# Altium schematic sheet СФ МЭИ ЛБ ПЭ2-18 11.03.04 03 Э3.SchDoc
size 594 x 420 mm; Scale: 1:1; Разраб.: Гончаренко В.Ю.; Пров.: Смолин В.А.; Номер листа: 1; Общее количество листов: 1; Наименование изделия 1: последовательности импульсов; Наименование изделия 2: последовательности импульсов; Наименование изделия 3: последовательности импульсов; Нач. отд.: Нач. отд.; Децимальный номер: СФ МЭИ ЛБ ПЭ2-18 11.03.04 03 Э3; Наименование. Строка 2: последовательности импульсов; Наименование. Строка 3: Схема электирическая принципиальная; Наименование. Строка 1: Генератор однополярной; Разработал: Гончаренк В.Ю.; Проверил: Амелин С.А.; Утвердил: Амелина М.А.; Литера: У; Масштаб: 1:1; Лист. Номер: 1; Лист. Всего: 1; Тип документа: Схема электрическая принципиальная
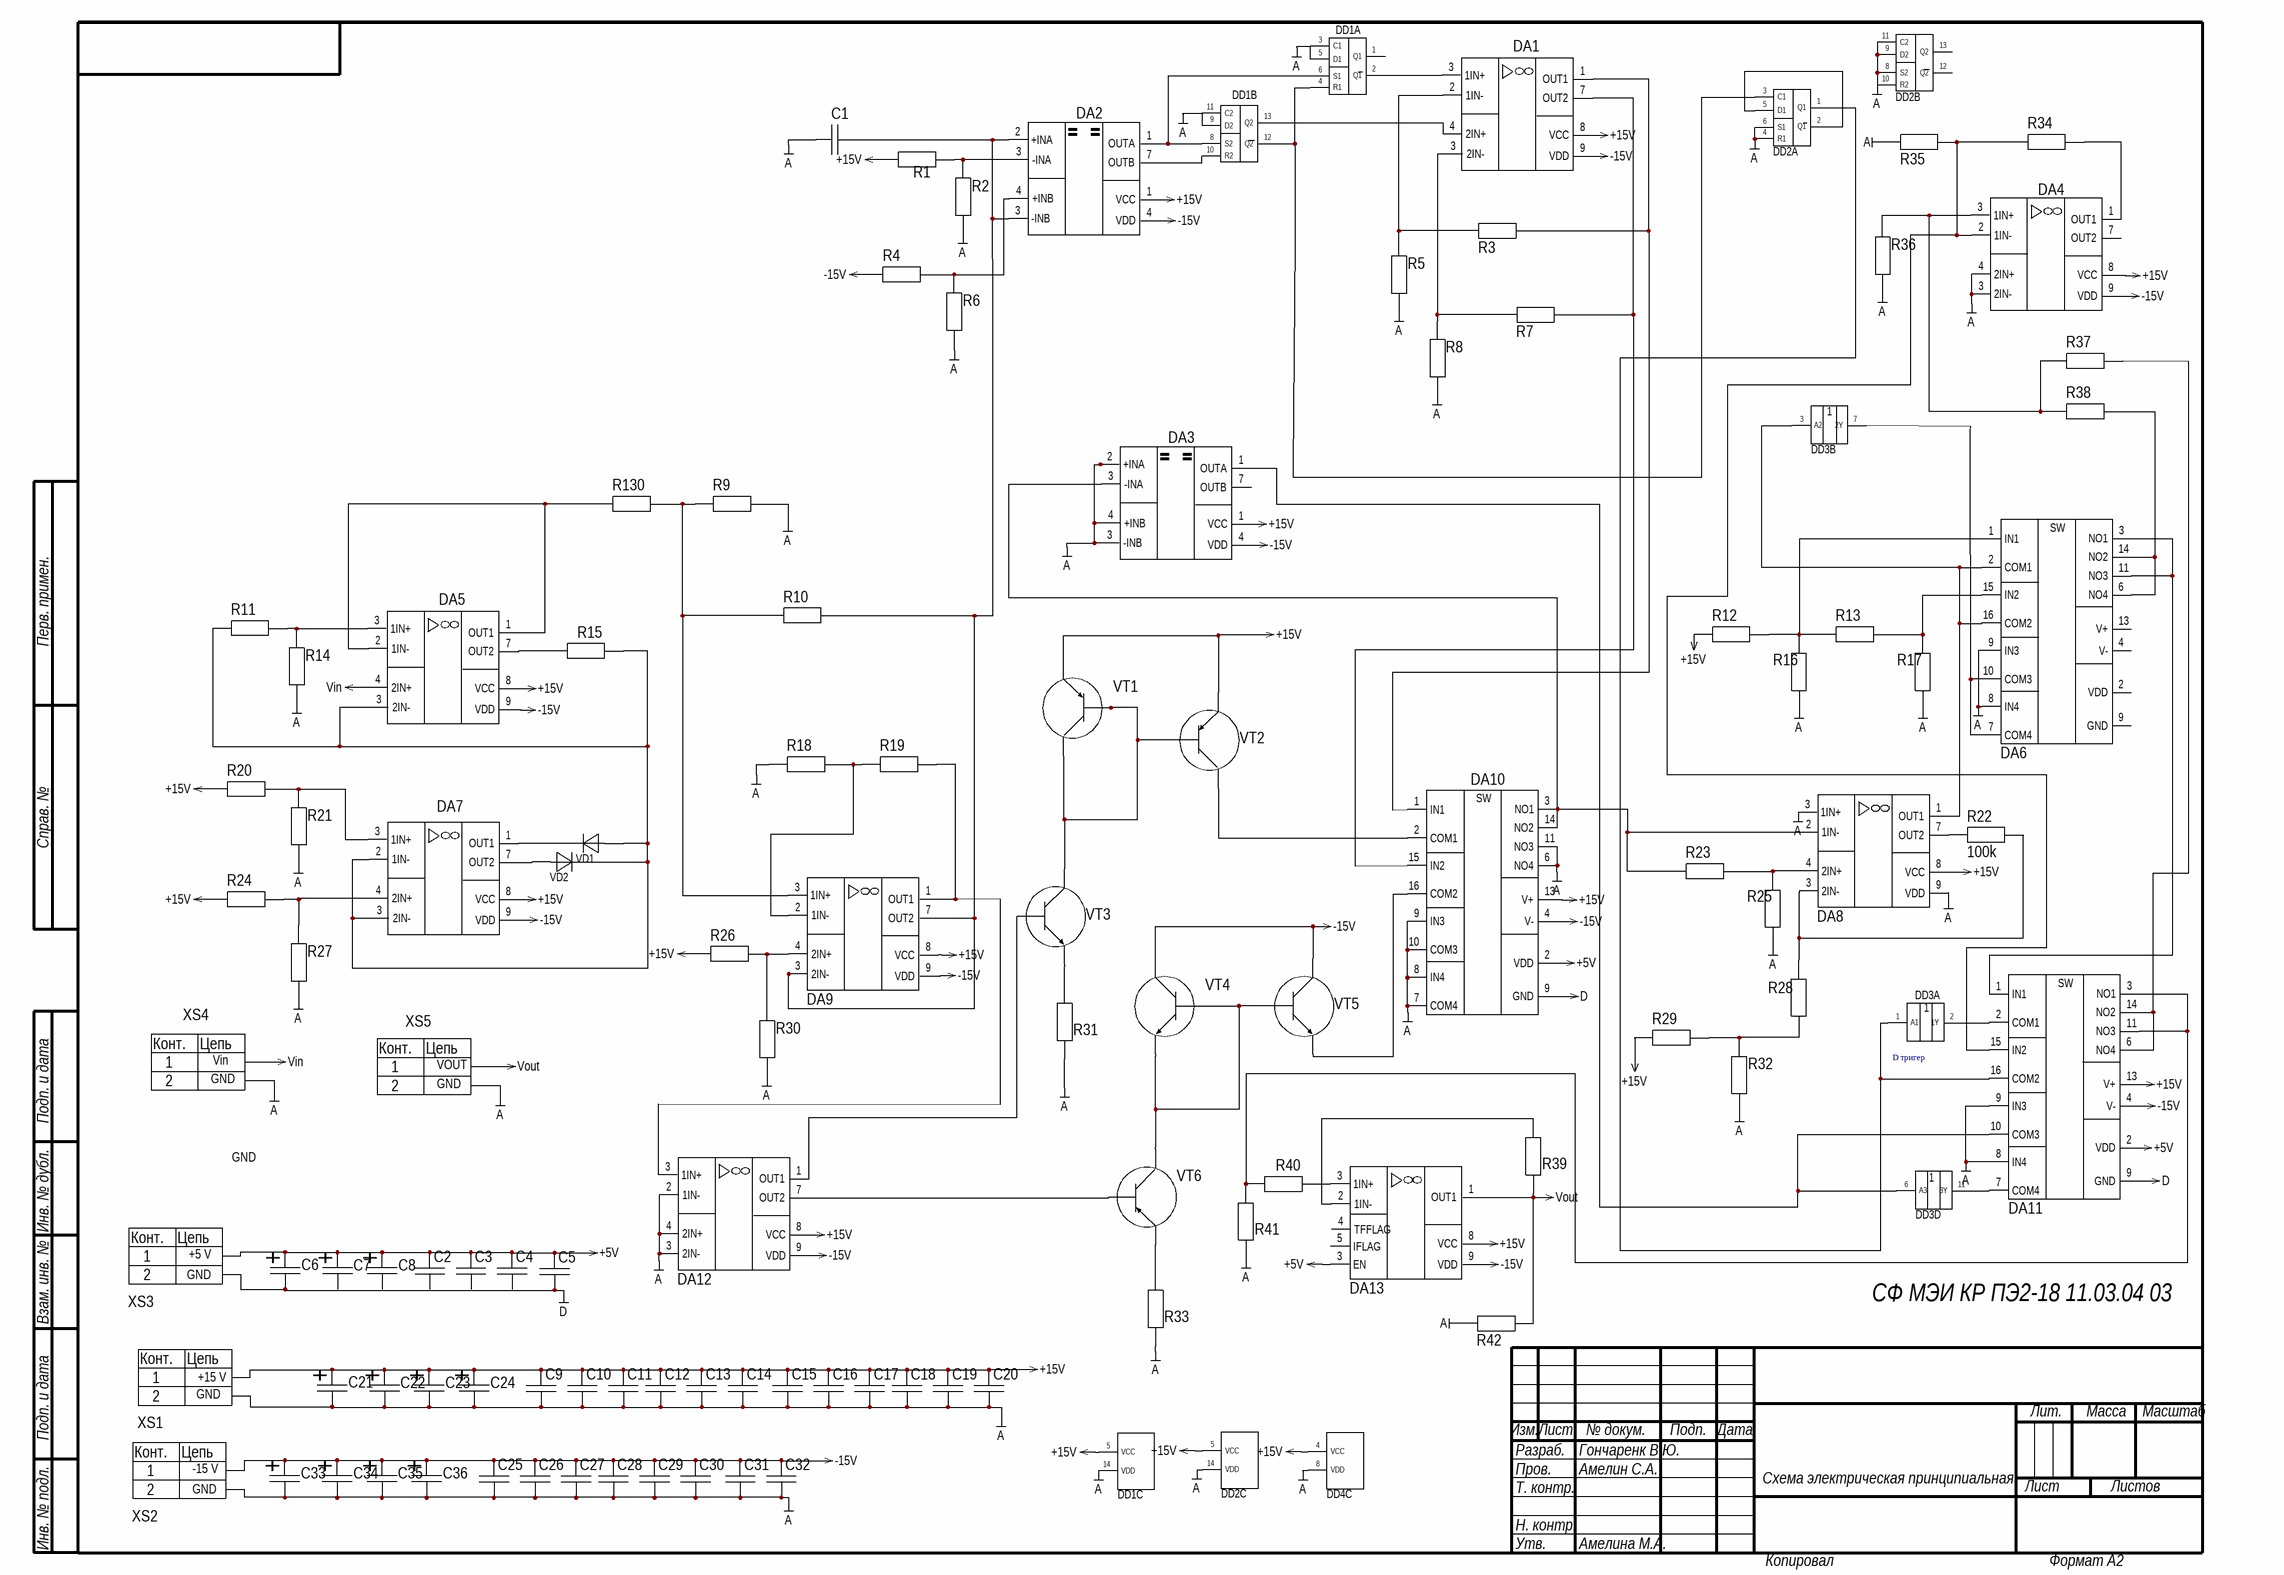
[diagram p0: СФ МЭИ ЛБ ПЭ2-18 11.03.04 03 Э3.SchDoc]

## Parts
C1  39n  [0805]  (value not drawn)
C2  39n  [0805]  (value not drawn)
C3  39n  [0805]  (value not drawn)
C4  39n  [0805]  (value not drawn)
C5  39n  [0805]  (value not drawn)
C6  1000  [ECAP SMD, 1 мкФ, 50В, Конденсатор электролитический алюминиевый SMD]  (value not drawn)
C7  1000  [ECAP SMD, 1 мкФ, 50В, Конденсатор электролитический алюминиевый SMD]  (value not drawn)
C8  1000  [ECAP SMD, 1 мкФ, 50В, Конденсатор электролитический алюминиевый SMD]  (value not drawn)
C9  39n  [0805]  (value not drawn)
C10  39n  [0805]  (value not drawn)
C11  39n  [0805]  (value not drawn)
C12  39n  [0805]  (value not drawn)
C13  39n  [0805]  (value not drawn)
C14  39n  [0805]  (value not drawn)
C15  39n  [0805]  (value not drawn)
C16  39n  [0805]  (value not drawn)
C17  39n  [0805]  (value not drawn)
C18  39n  [0805]  (value not drawn)
C19  39n  [0805]  (value not drawn)
C20  39n  [0805]  (value not drawn)
C21  1000  [ECAP SMD, 1 мкФ, 50В, Конденсатор электролитический алюминиевый SMD]  (value not drawn)
C22  1000  [ECAP SMD, 1 мкФ, 50В, Конденсатор электролитический алюминиевый SMD]  (value not drawn)
C23  1000  [ECAP SMD, 1 мкФ, 50В, Конденсатор электролитический алюминиевый SMD]  (value not drawn)
C24  1000  [ECAP SMD, 1 мкФ, 50В, Конденсатор электролитический алюминиевый SMD]  (value not drawn)
C25  39n  [0805]  (value not drawn)
C26  39n  [0805]  (value not drawn)
C27  39n  [0805]  (value not drawn)
C28  39n  [0805]  (value not drawn)
C29  39n  [0805]  (value not drawn)
C30  39n  [0805]  (value not drawn)
C31  39n  [0805]  (value not drawn)
C32  39n  [0805]  (value not drawn)
C33  1000  [ECAP SMD, 1 мкФ, 50В, Конденсатор электролитический алюминиевый SMD]  (value not drawn)
C34  1000  [ECAP SMD, 1 мкФ, 50В, Конденсатор электролитический алюминиевый SMD]  (value not drawn)
C35  1000  [ECAP SMD, 1 мкФ, 50В, Конденсатор электролитический алюминиевый SMD]  (value not drawn)
C36  1000  [ECAP SMD, 1 мкФ, 50В, Конденсатор электролитический алюминиевый SMD]  (value not drawn)
DA1  КФ140УД18  [SOIC-8]  (value not drawn)
DA2  КФ140УД18  [SOIC-8]  (value not drawn)
DA3  КФ140УД18  [SOIC-8]  (value not drawn)
DA4  КФ140УД18  [SOIC-8]  (value not drawn)
DA5  КФ140УД18  [SOIC-8]  (value not drawn)
DA6  КФ140УД18  [SOIC-8]  (value not drawn)
DA7  КФ140УД18  [SOIC-8]  (value not drawn)
DA8  КФ140УД18  [SOIC-8]  (value not drawn)
DA9  КФ140УД18  [SOIC-8]  (value not drawn)
DA10  КФ140УД18  [SOIC-8]  (value not drawn)
DA11  КФ140УД18  [SOIC-8]  (value not drawn)
DA12  КФ140УД18  [SOIC-8]  (value not drawn)
DA13  КФ140УД18  [SOIC-8]  (value not drawn)
DD1  CD43013B  [SOIC 14]  (value not drawn)  (parts A,B,C of 3)
DD2  CD43013B  [SOIC 14]  (value not drawn)  (parts A,B,C of 3)
DD3  CD43013B  [SOIC-8]  (value not drawn)  (parts A,B,D of 4)
DD4  CD43013B  [SOIC-8]  (value not drawn)  (part C of 4)
R1  13k  [0805]  (value not drawn)
R2  0,91k  [0805]  (value not drawn)
R3  13k  [0805]  (value not drawn)
R4  13k  [0805]  (value not drawn)
R5  0,91k  [0805]  (value not drawn)
R6  0,91k  [0805]  (value not drawn)
R7  13k  [0805]  (value not drawn)
R8  0,91k  [0805]  (value not drawn)
R9  13k  [0805]  (value not drawn)
R10  13k  [0805]  (value not drawn)
R11  130k  [0805]  (value not drawn)
R12  510k  [0805]  (value not drawn)
R13  1k  [0805]  (value not drawn)
R14  0,91k  [0805]  (value not drawn)
R15  1k  [0805]  (value not drawn)
R16  2k  [0805]  (value not drawn)
R17  1k  [0805]  (value not drawn)
R18  13k  [0805]  (value not drawn)
R19  13k  [0805]  (value not drawn)
R20  13k  [0805]  (value not drawn)
R21  0,91k  [0805]  (value not drawn)
R22  100k  [0805]
R23  100k  [0805]  (value not drawn)
R24  130k  [0805]  (value not drawn)
R25  100k  [0805]  (value not drawn)
R26  130k  [0805]  (value not drawn)
R27  0,91k  [0805]  (value not drawn)
R28  100k  [0805]  (value not drawn)
R29  3k  [0805]  (value not drawn)
R30  0,91k  [0805]  (value not drawn)
R31  13k  [0805]  (value not drawn)
R32  2k  [0805]  (value not drawn)
R33  13k  [0805]  (value not drawn)
R34  1k  [0805]  (value not drawn)
R35  0,91k  [0805]  (value not drawn)
R36  0,91k  [0805]  (value not drawn)
R37  1k  [0805]  (value not drawn)
R38  1k  [0805]  (value not drawn)
R39  13k  [0805]  (value not drawn)
R40  13k  [0805]  (value not drawn)
R41  13k  [0805]  (value not drawn)
R42  13k  [0805]  (value not drawn)
R130  1k  [0805]  (value not drawn)
VD1  Диод  [SOD-123]  (value not drawn)
VD2  Диод  [SOD-123]  (value not drawn)
VT1  PNP  [SOT23]  (value not drawn)
VT2  PNP  [SOT23]  (value not drawn)
VT3  NPN  [SOT23]  (value not drawn)
VT4  NPN  [SOT23]  (value not drawn)
VT5  NPN  [SOT23]  (value not drawn)
VT6  PNP  [SOT23]  (value not drawn)
XS1  220V 2 pin  [DG126-5.0-02P]  (value not drawn)
XS2  220V 2 pin  [DG126-5.0-02P]  (value not drawn)
XS3  220V 2 pin  [DG126-5.0-02P]  (value not drawn)
XS4  220V 2 pin  [DG126-5.0-02P]  (value not drawn)
XS5  220V 2 pin  [DG126-5.0-02P]  (value not drawn)

## Nets
+5V: C2.1 C3.1 C4.1 C5.1 C6.2 C7.2 C8.2 DA10.2(VDD) DA13.3(EN) XS3.1(Pin1)
+15V: C9.1 C10.1 C11.1 C12.1 C13.1 C14.1 C15.1 C16.1 C17.1 C18.1 C19.1 C20.1 C21.2 C22.2 C23.2 C24.2 DA1.8(VCC) DA2.1(VCC) DA3.1(VCC) DA4.8(VCC) DA5.8(VCC) DA7.8(VCC) DA8.8(VCC) DA9.8(VCC) DA10.13(V+) DA11.13(V+) DA12.8(VCC) DA13.8(VCC) DD1.5(VCC) DD2.5(VCC) DD4.4(VCC) R1.1 R12.1 R20.1 R24.1 R26.1 R29.1 VT1.2 VT2.2 XS1.1(Pin1)
-15V: C25.1 C26.1 C27.1 C28.1 C29.1 C30.1 C31.1 C32.1 C33.2 C34.2 C35.2 C36.2 DA1.9(VDD) DA2.4(VDD) DA3.4(VDD) DA4.9(VDD) DA5.9(VDD) DA7.9(VDD) DA9.9(VDD) DA10.4(V-) DA11.4(V-) DA12.9(VDD) DA13.9(VDD) R4.1 VT4.2 VT5.2 XS2.1(Pin1)
A: C1.1 C9.2 C10.2 C11.2 C12.2 C13.2 C14.2 C15.2 C16.2 C17.2 C18.2 C19.2 C20.2 C21.1 C22.1 C23.1 C24.1 C25.2 C26.2 C27.2 C28.2 C29.2 C30.2 C31.2 C32.2 C33.1 C34.1 C35.1 C36.1 DA3.2(+INA) DA3.3(-INB) DA3.4(+INB) DA4.3(2IN-) DA4.4(2IN+) DA6.8(IN4) DA6.9(IN3) DA8.3(1IN+) DA8.9(VDD) DA10.6(NO4) DA10.7(COM4) DA10.8(IN4) DA10.9(IN3) DA10.10(COM3) DA10.11(NO3) DA11.8(IN4) DA11.9(IN3) DA12.2(1IN-) DA12.3(2IN-) DA12.4(2IN+) DD1.3(С1) DD1.5(D1) DD1.9(D2) DD1.11(C2) DD1.14(VDD) DD2.4(R1) DD2.6(S1) DD2.8(S2) DD2.9(D2) DD2.10(R2) DD2.11(C2) DD2.14(VDD) DD4.8(VDD) R2.1 R5.1 R6.1 R8.1 R9.2 R14.1 R16.2 R17.2 R18.1 R21.1 R25.2 R27.1 R30.1 R31.1 R32.2 R33.1 R35.1 R36.1 R41.2 R42.2 XS1.2(Pin2) XS2.2(Pin2) XS4.2(Pin2) XS5.2(Pin2)
D: C5.2 C6.1 DA10.9(GND) DA11.9(GND) XS3.2(Pin2)
Vin: DA5.4(2IN+) XS4.1(Pin1)
Vout: DA13.1(OUT1) R39.2 R42.1 XS5.1(Pin1)
NetC1_2: C1.2 DA2.2(+INA) DA2.3(-INB) DA9.3(2IN-) DA9.7(OUT2) R10.2
NetDA1_1: DA1.1(OUT1) DA10.1(IN1) R3.1
NetDA1_2: DA1.2(1IN-) R3.2 R5.2
NetDA1_3: DA1.3(1IN+) DD1.2(Q1)
NetDA1_3: DA1.3(2IN-) R7.2 R8.2  [a separate net that carries the same name]
NetDA1_4: DA1.4(2IN+) DD1.13(Q2)
NetDA1_7: DA1.7(OUT2) DA10.15(IN2) R7.1
NetDA2_1: DA2.1(OUTA) DD1.6(S1) DD1.8(S2)
NetDA2_3: DA2.3(-INA) R1.2 R2.2
NetDA2_4: DA2.4(+INB) R4.2 R6.2
NetDA2_7: DA2.7(OUTB) DD1.10(R2)
NetDA3_1: DA3.1(OUTA) DA11.10(COM3) DD3.6(A3)
NetDA3_3: DA3.3(-INA) DA8.2(1IN-) DA10.3(NO1) DA10.14(NO2) R23.1
NetDA4_1: DA4.1(OUT1) R34.2
NetDA4_2: DA4.2(1IN-) DA11.15(IN2) R34.1 R35.2
NetDA4_3: DA4.3(1IN+) R36.2 R37.1 R38.1
NetDA5_1: DA5.1(OUT1) DA5.2(1IN-) R130.1
NetDA5_3: DA5.3(2IN-) DA7.2(1IN-) DA7.3(2IN-) R11.1 R15.2 VD1.1(In) VD2.2(Out)
NetDA5_3: DA5.3(1IN+) R11.2 R14.2  [a separate net that carries the same name]
NetDA5_7: DA5.7(OUT2) R15.1
NetDA6_1: DA6.1(IN1) R12.2 R13.1 R16.1
NetDA6_2: DA6.2(COM1) DA6.16(COM2) DA8.1(OUT1) DD3.3(A2)
NetDA6_3: DA6.3(NO1) DA6.11(NO3) DA11.1(IN1)
NetDA6_6: DA6.6(NO4) DA6.14(NO2) R38.2
NetDA6_7: DA6.7(COM4) DA6.10(COM3) DD3.7(2Y)
NetDA6_15: DA6.15(IN2) R13.2 R17.1
NetDA7_1: DA7.1(OUT1) VD1.2(Out)
NetDA7_3: DA7.3(1IN+) R20.2 R21.2
NetDA7_4: DA7.4(2IN+) R24.2 R27.2
NetDA7_7: DA7.7(OUT2) VD2.1(In)
NetDA8_3: DA8.3(2IN-) R22.2 R28.1
NetDA8_4: DA8.4(2IN+) R23.2 R25.1
NetDA8_7: DA8.7(OUT2) R22.1
NetDA9_1: DA9.1(OUT1) DA12.3(1IN+) R19.2
NetDA9_2: DA9.2(1IN-) R18.2 R19.1
NetDA9_3: DA9.3(1IN+) R9.1 R10.1 R130.2
NetDA9_4: DA9.4(2IN+) R26.2 R30.2
NetDA10_2: DA10.2(COM1) VT2.3
NetDA10_16: DA10.16(COM2) VT5.3
NetDA11_2: DA11.2(COM1) DD3.2(1Y)
NetDA11_3: DA11.3(NO1) DA11.11(NO3) R40.2 R41.1
NetDA11_6: DA11.6(NO4) DA11.14(NO2) R37.2
NetDA11_7: DA11.7(COM4) DD3.11(3Y)
NetDA11_16: DA11.16(COM2) DD2.1(Q1) DD3.1(A1)
NetDA12_1: DA12.1(OUT1) VT3.1
NetDA12_7: DA12.7(OUT2) VT6.1
NetDA13_2: DA13.2(1IN-) R39.1
NetDA13_3: DA13.3(1IN+) R40.1
NetDD1_4: DD1.4(R1) DD1.12(Q2) DD2.3(С1)
NetDD2_2: DD2.2(Q1) DD2.5(D1)
NetR28_2: R28.2 R29.2 R32.1
NetR31_2: R31.2 VT3.3
NetR33_2: R33.2 VT6.2
NetVT1_1: VT1.1 VT1.3 VT2.1 VT3.2
NetVT4_1: VT4.1 VT4.3 VT5.1 VT6.3

Not connected (* = marked no-connect by the designer): C2 2; C3 2; C4 2; C7 1; C8 1; DA3 7(OUTB); DA4 7(OUT2); DA6 4(V-) 13(V+); DA13 4(TFFLAG) 5(IFLAG); DD1 1(Q1); DD2 12(Q2) 13(Q2)

## Notes on the sheet
- (near XS4) Vin
- (near DD3) D тригер
- (near XS4) GND
- (near XS5) GND
- (near XS5) VOUT
- GND
- (near XS3) GND
- (near XS3) +5 V
- СФ МЭИ КР ПЭ2-18 11.03.04 03
- (near XS1) GND
- (near XS1) +15 V
- (near XS2) GND
- (near XS2) -15 V
- Labels drawn without touching a wire or pin: +5V
- Перв. примен.
- Справ. №
- Подп. и дата
- Инв. № дубл.
- Взам. инв. №
- Разраб.
- Изм.
- Лист
- № докум.
- Подп.
- Дата
- Лит.
- Масса
- Масштаб
- Пров.
- Т. контр.
- Листов
- Инв. № подл.
- Н. контр.
- Утв.
- Копировал
- Формат А2
- (in symbol 220V 2 pin) Конт.; Цепь
- (in symbol SMD Конденсатор полярный) +
- (in symbol Ключ) SW

## Library data of the parts
C1-C5 C9-C20 C25-C32 = К53-68"R"-25В-0.039 мкФ ±10% 0805: К53-68"R"-25В-0.039 мкФ ±10%
C6-C8 C21-C24 C33-C36 = SMD Конденсатор полярный: К53-68"R"-25В-1000 пФ ±10%
DA1 DA4 DA5 DA7-DA9 DA12 = ОУ
DA2 DA3 = Компаратор
DA6 DA10 DA11 = Ключ
DA13 = ОУ Силовой
DD3 DD4 = Ивертор
R1 R3 R4 R7 R11 R20 = 0.125Вт 0805 13 кОм, 5%, Чип резистор (SMD): 0805-0.125 Вт -13 кОм±5%
R2 R5 R6 R8 R14 R21 R27 R30 R35 R36 = 0.125Вт 0805 0,91 кОм, 5%, Чип резистор (SMD): 0805-0.125 Вт -0,91 кОм±5%
R9 R10 R15 R18 R19 R31 R33 R39-R42 R130 = 0.125Вт 0805 1 кОм, 5%, Чип резистор (SMD): 0805-0.125 Вт -1 кОм±5%
R12 R13 R16 R17 R22 R23 R25 R28 R29 R32 R34 R37 R38 = 0.125Вт 0805 0,51 кОм, 5%, Чип резистор (SMD): 0805-0.125 Вт -3 кОм±5%
R24 R26 = 0.125Вт 0805 130 кОм, 5%, Чип резистор (SMD): 0805-0.125 Вт -130 кОм±5%
VD1 VD2 = Диод: MMSZ5235B
VT1 VT2 VT6 = PNP: SI2304DDS-T1-GE3
VT3-VT5 = NPN: SI2304DDS-T1-GE3
XS1-XS5 = 220V 2 pin: DG126-5.0-0.2P